# Altium schematic sheet ELoad_rev0.1.SchDoc
size A3
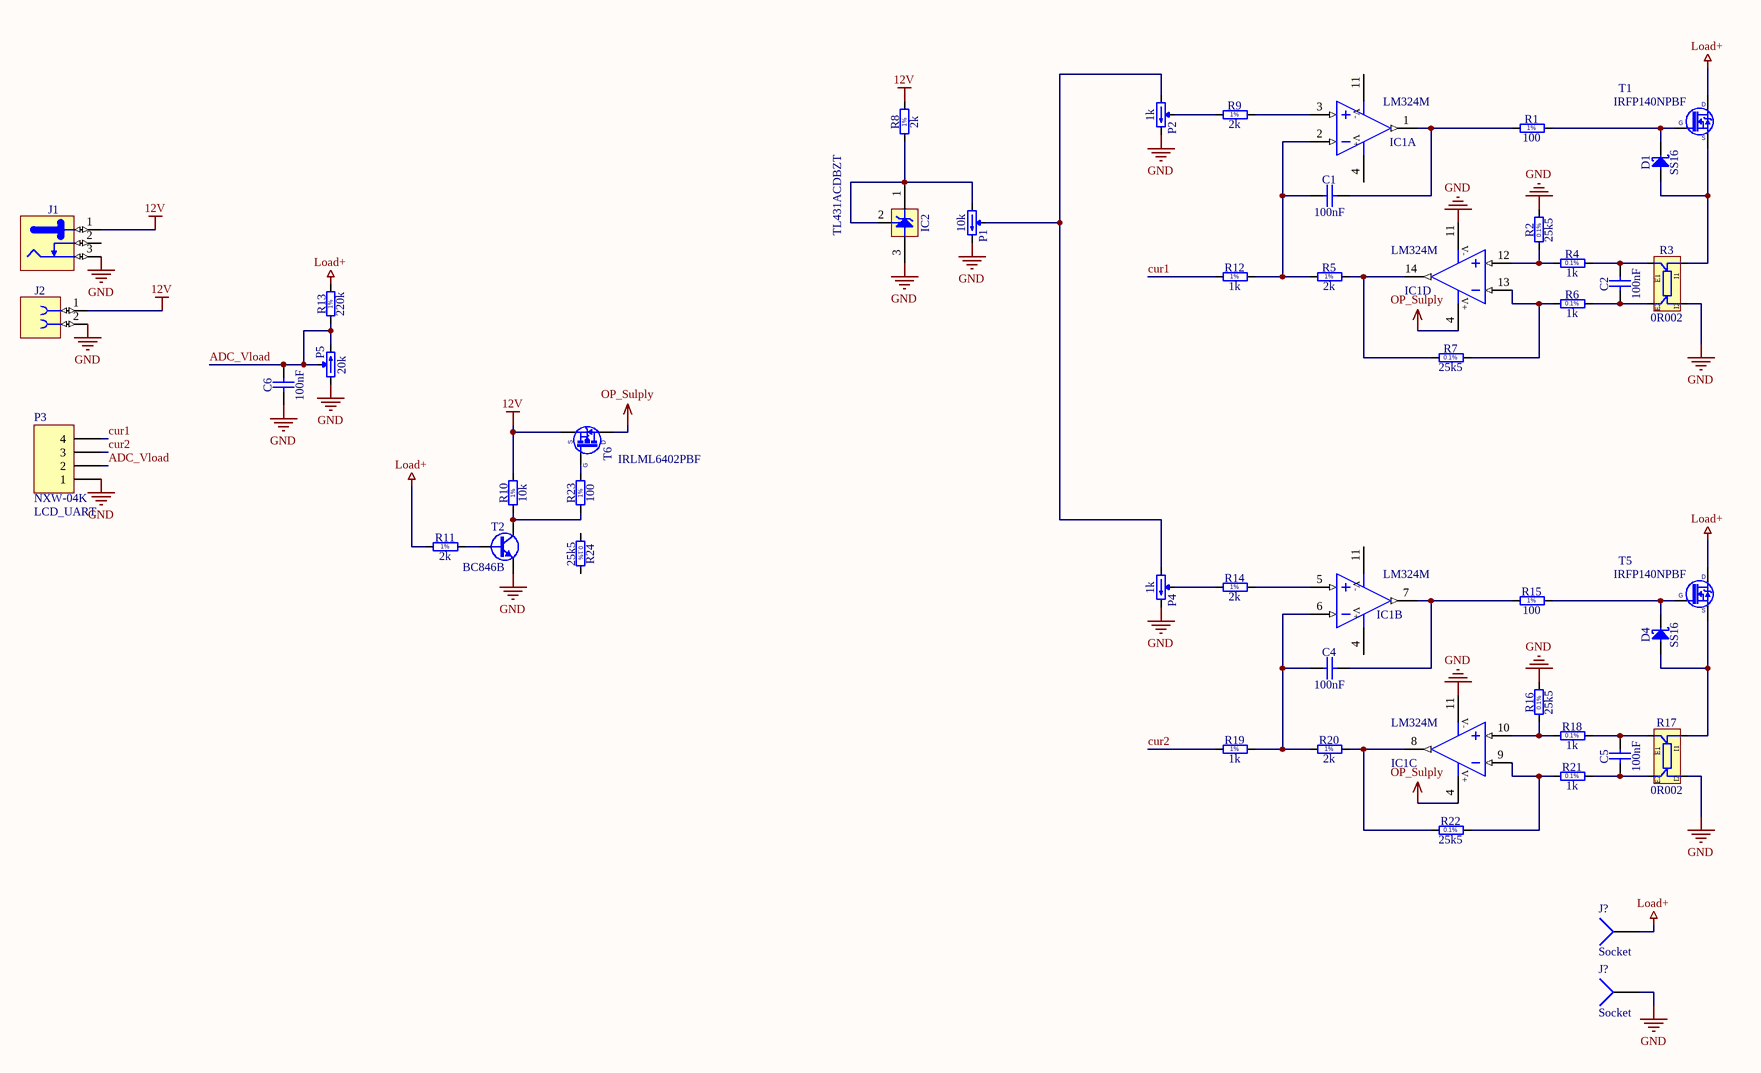
[diagram p0: ELoad_rev0.1.SchDoc]

## Parts
(Parts that share a designator on the sheet are numbered #1, #2 ... from top to bottom, then left to right.)
C1  100nF  [CAPC2012X135N]
C2  100nF  [CAPC2012X135N]
C4  100nF  [CAPC2012X135N]
C5  100nF  [CAPC2012X135N]
C6  100nF  [CAPC2012X88N]
D1  SS16  [DIOM5127X229N]
D4  SS16  [DIOM5127X229N]
IC1  LM324M  [SOIC127P600X175-14N]  (parts A,B,C,D of 4)
IC2  TL431ACDBZT  [SOT95P237X112-3N]
J1  Jack  [CLIFF_FC68148(DC-10A)]  (value not drawn)
J2  (no value)  [PHOENIX_1792863]
J?#1  Socket  [PIN1]
J?#2  Socket  [PIN1]
P1  10k  [3590S]
P2  1k  [TRIM_BOURNS_3290W]
P3  NXW-04K  Parameter 1: LCD_UART  [NXW-04K]
P4  1k  [TRIM_BOURNS_3290W]
P5  20k  [TRIM_BOURNS_3290W]
R1  100  [RESC2012X60N]
R2  25k5  [RESC2012X60N]
R3  0R002  [RES_VISHAY_WSK2512_0R005-0R2]
R4  1k  [RESC2012X60N]
R5  2k  [RESC2012X60N]
R6  1k  [RESC2012X60N]
R7  25k5  [RESC2012X60N]
R8  2k  [RESC2012X60N]
R9  2k  [RESC2012X60N]
R10  10k  [RESC2012X60N]
R11  2k  [RESC2012X60N]
R12  1k  [RESC2012X60N]
R13  220k  [RESC2012X60N]
R14  2k  [RESC2012X60N]
R15  100  [RESC2012X60N]
R16  25k5  [RESC2012X60N]
R17  0R002  [RES_VISHAY_WSK2512_0R005-0R2]
R18  1k  [RESC2012X60N]
R19  1k  [RESC2012X60N]
R20  2k  [RESC2012X60N]
R21  1k  [RESC2012X60N]
R22  25k5  [RESC2012X60N]
R23  100  [RESC2012X60N]
R24  25k5  [RESC2012X60N]
T1  IRFP140NPBF  [TO-247AC-v]
T2  BC846B  [SOT95P230X110-3N]
T5  IRFP140NPBF  [TO-247AC-v]
T6  IRLML6402PBF  [SOT95P237X112-3N]

## Nets
12V: J1.1 J2.1 R8.2 R10.2 T6.2(S)
GND: C6.1 IC1.11(V-) IC2.3(A) J1.3 J2.2 J?#2.1 P1.3(CW) P2.3(CW) P3.1 P4.3(CW) P5.1(CCW) R2.2 R3.I2 R16.2 R17.I2 T2.2(E)
Load+: J?#1.1 R11.1 R13.2 T1.2(D) T5.2(D)
OP_Sulply: IC1.4(V+) T6.3(D)
ADC_Vload: C6.2 P3.2 P5.2(W) P5.3(CW) R13.1
cur1: P3.4 R12.1
cur2: P3.3 R19.1
NetC1_1: C1.1 IC1.2(IN-) R5.1 R12.2
NetC1_2: C1.2 IC1.1(OUT) R1.1
NetC2_1: C2.1 R3.E2 R6.2
NetC2_2: C2.2 R3.E1 R4.2
NetC4_1: C4.1 IC1.6(IN-) R19.2 R20.1
NetC4_2: C4.2 IC1.7(OUT) R15.1
NetC5_1: C5.1 R17.E2 R21.2
NetC5_2: C5.2 R17.E1 R18.2
NetD1_1: D1.1(C) R1.2 T1.1(G)
NetD1_2: D1.2(A) R3.I1 T1.3(S)
NetD4_1: D4.1(C) R15.2 T5.1(G)
NetD4_2: D4.2(A) R17.I1 T5.3(S)
NetIC1_3: IC1.3(IN+) R9.2
NetIC1_5: IC1.5(IN+) R14.2
NetIC1_8: IC1.8(OUT) R20.2 R22.1
NetIC1_9: IC1.9(IN-) R21.1 R22.2
NetIC1_10: IC1.10(IN+) R16.1 R18.1
NetIC1_12: IC1.12(IN+) R2.1 R4.1
NetIC1_13: IC1.13(IN-) R6.1 R7.2
NetIC1_14: IC1.14(OUT) R5.2 R7.1
NetIC2_1: IC2.1(C) IC2.2(Adj) P1.1(CCW) R8.1
NetP1_2: P1.2(W) P2.1(CCW) P4.1(CCW)
NetP2_2: P2.2(W) R9.1
NetP4_2: P4.2(W) R14.1
NetR10_1: R10.1 R23.1 T2.3(C)
NetR11_2: R11.2 T2.1(B)
NetR23_2: R23.2 T6.1(G)

Not connected (* = marked no-connect by the designer): J1 2; R24 1 2

## Notes on the sheet
- Title
- Size:
- Date:
- A3
- Number:
- Time:
- Revision:
- Sheet
- of
- File:
- (in symbol R0805_1K_0.1%_0.125W_25PPM) 0.1%
- (in symbol R0805_1K_1%_0.125W_100PPM) 1%
- (in symbol R0805_2K_1%_0.125W_100PPM) 1%
- (in symbol R0805_10K_1%_0.125W_100PPM) 1%
- (in symbol R0805_25K5_0.1%_0.1W_10PPM) 0.1%
- (in symbol R0805_100R_1%_0.125W_100PPM) 1%
- (in symbol R0805_220K_1%_0.125W_100PPM) 1%

## Library data of the parts
C1 C2 C4 C5 = CC0805_100NF_50V_10%_X7R: Non-polarised capacitor; Part Description: SMD Multilayer Chip Ceramic Capacitor; Manufacturer: GENERIC; Manufacturer1 Part Number: C2012X7R1H104K085AA; Voltage: 50V; TC: X7R; Tolerance: ±10%; Part Number: CC0805_100NF_50V_10%_X7R; Component Kind: Standard; Component Type: Standard; Pin Count: 2; Value: 100nF; Status: Preferred; Manufacturer Part Number: CC0805_100NF_50V_10%_X7R; Case: 0805; Mounted: Yes; Socket: No; SMD: Yes; Sense: No; Manufacturer1 Example: TDK; Manufacturer1 ComponentHeight: 1mm; HelpURL: \\cern.ch\dfs\Applications\Altium\Datasheets\CC0805_X7R_TDK_C.pdf; Author: CERN DEM JLC; CreateDate: 12/3/2007; LatestRevisionDate: 4/22/2015
C6 = CC0805_100NF_50V_10%_X7R_YUDEN_UMK212B7104KGH: Non-polarised capacitor; Part Description: SMD Multilayer Chip Ceramic Capacitor (High Dielectric Type) for Automotive / Industrial Applications; Manufacturer: TAIYO YUDEN; Voltage: 50V; TC: X7R; Tolerance: ±10%; Part Number: CC0805_100NF_50V_10%_X7R_YUDEN_UMK212B7104KGH; Component Kind: Standard; Component Type: Standard; Pin Count: 2; Value: 100nF; Status: Not Recommended; Manufacturer Part Number: UMK212B7104KGH; Case: 0805; Mounted: Yes; Socket: No; SMD: Yes; Sense: No; ComponentHeight: 1.35mm; HelpURL: \\cern.ch\dfs\Applications\Altium\Datasheets\CC0805_TAIYO-YUDEN_UMK212B7104KGH.pdf; Author: CERN DEM JLC; CreateDate: 23.04.2015; LatestRevisionDate: 23.04.2015
D1 D4 = SS16: Schottky Diode; Part Description: Surface Mount Schottky Barrier Rectifier; Manufacturer: VISHAY GENERAL SEMICONDUCTOR; Voltage: 60V; Power: 1A; PressFit: No; Bonding: No; Part Number: SS16; Component Kind: Standard; Component Type: Standard; Device: SS16; PackageDescription: DO-214-AC Molded Diode, Body 5.1x2.7mm, IPC Medium Density; Manufacturer Part Number: SS16; Pin Count: 2; Case: DO-214AC; Mounted: Yes; Socket: No; SMD: Yes; Sense: No; ComponentHeight: 2.29mm; HelpURL: \\cern.ch\dfs\Applications\Altium\Datasheets\SS16.pdf; Author: CERN DEM JLC; CreateDate: 7/15/2008; LatestRevisionDate: 8/23/2010
IC1 = LM324M: Quad Operational Amplifier; Manufacturer: FAIRCHILD SEMICONDUCTOR; PressFit: No; Bonding: No; Part Number: LM324M; Component Kind: Standard; Component Type: Standard; Device: LM324M; PackageDescription: SOIC 14, Pitch 1.27mm - Body 4x8.75mm, IPC Medium Density; Status: Not recommended; Part Description: Quad Operational Amplifier; Manufacturer Part Number: LM324M; Pin Count: 14; Case: SOIC14; Mounted: Yes; Socket: No; SMD: Yes; Sense: No; ComponentHeight: 1.80mm; Author: CERN DEM JLC; HelpURL: \\cern.ch\dfs\Applications\Altium\Datasheets\LM324M.pdf; CreateDate: 8/20/2008; LatestRevisionDate: 8/20/2008
IC2 = TL431ACDBZT: Precision Reference 1=Cathode 2=Adj 3=Anode; Part Description: Vref (2.5V) To 36V 1% Precision Programmable Reference; Manufacturer: TEXAS INSTRUMENTS; PressFit: No; Bonding: No; Part Number: TL431ACDBZT; Component Kind: Standard; Component Type: Standard; Device: TL431ACDBZT; PackageDescription: SOT, 0.95mm, Pitch; 3 pin,1.30mm W X 2.92mm L X 1.12mm H Body, IPC Medium Density; Manufacturer Part Number: TL431ACDBZT; Pin Count: 3; Case: SOT23; Mounted: Yes; Socket: No; SMD: Yes; Sense: No; ComponentHeight: 1.12mm; HelpURL: \\cern.ch\dfs\Applications\Altium\Datasheets\TL431ACDBZT.pdf; Author: CERN DEM JLC; CreateDate: 2/28/2011; LatestRevisionDate: 2/28/2011
J1 = CLIFF_FC68148(DC-10A): 12V /  5A, 2.1mm Diameter Pin, DC Power Socket With  Switch. DC10A Type; Part Description: 12V/5A, 2.1mm Diameter Pin, DC Power Socket With  Switch (DC10A Type); Manufacturer: CLIFF ELECTRONIC COMPONENTS; PressFit: No; Part Number: CLIFF_FC68148(DC-10A); Component Kind: Standard; Component Type: Standard; Pin Count: 3; Family: Jack; Mounted: Yes; Socket: No; SMD: No; Sense: No; Status: None; Manufacturer Part Number: FC68148 (DC-10A); ComponentHeight: 11mm; HelpURL: \\cern.ch\dfs\Applications\Altium\Datasheets\CLIFF_FC68148(DC-10A).pdf; Author: CERN DEM JLC; CreateDate: 11/23/2010; LatestRevisionDate: 11/23/2010
J2 = PHOENIX_1792863: Connector 2 Female; Part Description: 12A 400V, Pitch: 5mm, 2 Positions Terminal Block (Spring-Cage Connection); Manufacturer: PHOENIX CONTACT; Manufacturer Part Number: 1792863 (PTS 1,5/ 2-5,0-H); PressFit: No; Part Number: PHOENIX_1792863; Component Kind: Standard; Component Type: Standard; Pin Count: 2; Mounted: Yes; Socket: No; SMD: No; Sense: No; Status: None; ComponentHeight: 9.2mm; HelpURL: \\cern.ch\dfs\Applications\Altium\Datasheets\PHOENIX_1792863.pdf; Author: CERN DEM JLC; CreateDate: 3/24/2014; LatestRevisionDate: 3/24/2014
P1 = TRIM_25T_10K_BOURNS_3296Y-1-103LF: Trimming Potentiometer; Part Description: 25 Turn Trimming Potentiometer (Top Adjustement); Manufacturer: BOURNS; Power: 0.5W; TC: ±100ppm/°C; Tolerance: ±10%; PressFit: No; Part Number: TRIM_25T_10K_BOURNS_3296Y-1-103LF; Component Kind: Standard; Component Type: Standard; Footprint: TRIM_BOURNS_3296Y; Pin Count: 3; Value: 10k; Manufacturer Part Number: 3296Y-1-103LF; Case: 3296Y; Mounted: Yes; Socket: No; SMD: No; Sense: No; ComponentHeight: 11.55mm; HelpURL: \\cern.ch\dfs\Applications\Altium\Datasheets\TRIM_BOURNS_3296Y.pdf; Author: CERN DEM JLC; CreateDate: 10/20/2008; LatestRevisionDate: 11/28/2012
P2 P4 = TRIM_25T_1K_BOURNS_3290W-1-102: Trimming Potentiometer; Part Description: 25 Turn Trimming Potentiometer (Top Adjustement); Manufacturer: BOURNS; Power: 1W; TC: ±50ppm/°C; Tolerance: ±5%; PressFit: No; Part Number: TRIM_25T_1K_BOURNS_3290W-1-102; Component Kind: Standard; Component Type: Standard; Pin Count: 3; Value: 1k; Manufacturer Part Number: 3290W-1-102; Case: 3290W; Mounted: Yes; Socket: No; SMD: No; Sense: No; ComponentHeight: 9.91mm; HelpURL: \\cern.ch\dfs\Applications\Altium\Datasheets\TRIM_BOURNS_3290W.pdf; Author: CERN DEM MR; CreateDate: 11/23/2016; LatestRevisionDate: 11/23/2016
P3 = Header 4: Header, 4-Pin; LatestRevisionDate: 17-Jul-2002; LatestRevisionNote: Re-released for DXP Platform.; Publisher: Altium Limited
P5 = TRIM_25T_20K_BOURNS_3290W-1-203: Trimming Potentiometer; Part Description: 25 Turn Trimming Potentiometer (Top Adjustement); Manufacturer: BOURNS; Power: 1W; TC: ±50ppm/°C; Tolerance: ±5%; PressFit: No; Part Number: TRIM_25T_20K_BOURNS_3290W-1-203; Component Kind: Standard; Component Type: Standard; Pin Count: 3; Value: 20k; Manufacturer Part Number: 3290W-1-203; Case: 3290W; Mounted: Yes; Socket: No; SMD: No; Sense: No; ComponentHeight: 9.91mm; HelpURL: \\cern.ch\dfs\Applications\Altium\Datasheets\TRIM_BOURNS_3290W.pdf; Author: CERN DEM BC; CreateDate: 3/1/2017; LatestRevisionDate: 3/1/2017
R1 R15 R23 = R0805_100R_1%_0.125W_100PPM: Resistor - 1%; Part Description: General Purpose Thick Film Chip Resistor; Manufacturer: GENERIC; Manufacturer1 Part Number: NRC10F4700TRF; Power: 0.125W; TC: ±100ppm/°C; PressFit: No; Part Number: R0805_100R_1%_0.125W_100PPM; Component Kind: Standard; Component Type: Standard; Pin Count: 2; Value: 100; Status: Preferred; Tolerance: ±1%; Manufacturer Part Number: R0805_100R_1%_0.125W_100PPM; Case: 0805; Mounted: Yes; Sense: No; Socket: No; SMD: Yes; Manufacturer1 Example: NIC COMPONENT; Manufacturer1 ComponentHeight: 0.6mm; HelpURL: \\cern.ch\dfs\Applications\Altium\Datasheets\R0805_NIC_NRC.pdf; Author: CERN DEM JLC; CreateDate: 12/3/2007; LatestRevisionDate: 3/13/2008
R2 R7 R16 R22 R24 = R0805_25K5_0.1%_0.1W_10PPM: Resistor - 0.1%; Part Description: Thin Film Chip Resistor; Manufacturer: GENERIC; Manufacturer1 Part Number: RN73C2A25K5BTG; Power: 0.1W; TC: ±10ppm; PressFit: No; Part Number: R0805_25K5_0.1%_0.1W_10PPM; Component Kind: Standard; Component Type: Standard; Pin Count: 2; Value: 25k5; Status: Not Recommended; Tolerance: ±0.1%; Manufacturer Part Number: R0805_25K5_0.1%_0.1W_10PPM; Case: 0805; Mounted: Yes; Sense: No; Socket: No; SMD: Yes; Manufacturer1 Example: TYCO HOLSWORTHY; Manufacturer1 ComponentHeight: 0.6mm; HelpURL: \\cern.ch\dfs\Applications\Altium\Datasheets\R0805_Tyco_RN73.pdf; Author: CERN DEM JLC; CreateDate: 12/3/2007; LatestRevisionDate: 3/13/2008
R3 R17 = R2512_0R002_1%_1W_35PPM_VISHAY_WSK2512: Power and Current Sensing Resistor; Part Description: Power Metal Strip® Resistor, Low Value; Manufacturer: VISHAY DALE; Manufacturer Part Number: WSK25122L000FEA; Power: 1W; TC: ±35ppm/°C; Tolerance: ±1%; PressFit: No; Part Number: R2512_0R002_1%_1W_35PPM_VISHAY_WSK2512; Component Kind: Standard; Component Type: Standard; Pin Count: 4; Value: 0R002; Status: None; Case: 2512; Mounted: Yes; Sense: No; Socket: No; SMD: Yes; ComponentHeight: 0.89mm; HelpURL: \\cern.ch\dfs\Applications\Altium\Datasheets\R2512_VISHAY_WSK2512.pdf; Author: CERN DEM MR; CreateDate: 11/8/2016; LatestRevisionDate: 11/8/2016
R4 R6 R18 R21 = R0805_1K_0.1%_0.125W_25PPM: Resistor - 0.1%; Part Description: Thin Film Chip Resistor; Manufacturer: GENERIC; Manufacturer1 Part Number: ERA6AEB102V; Power: 0.125W; TC: ±25ppm; PressFit: No; Part Number: R0805_1K_0.1%_0.125W_25PPM; Component Kind: Standard; Component Type: Standard; Pin Count: 2; Value: 1k; Status: Not Recommended; Tolerance: ±0.1%; Manufacturer Part Number: R0805_1K_0.1%_0.125W_25PPM; Case: 0805; Mounted: Yes; Sense: No; Socket: No; SMD: Yes; Manufacturer1 Example: PANASONIC; Manufacturer1 ComponentHeight: 0.6mm; HelpURL: \\cern.ch\dfs\Applications\Altium\Datasheets\R0805_PANASONIC_ERA.pdf; Author: CERN DEM JLC; CreateDate: 10/18/2010; LatestRevisionDate: 10/18/2010
R5 R8 R9 R11 R14 R20 = R0805_2K_1%_0.125W_100PPM: Resistor - 1%; Part Description: General Purpose Thick Film Chip Resistor; Manufacturer: GENERIC; Manufacturer1 Part Number: NRC10F2001TRF; Power: 0.125W; TC: ±100ppm/°C; PressFit: No; Part Number: R0805_2K_1%_0.125W_100PPM; Component Kind: Standard; Component Type: Standard; Pin Count: 2; Value: 2k; Status: Preferred; Tolerance: ±1%; Manufacturer Part Number: R0805_2K_1%_0.125W_100PPM; Case: 0805; Mounted: Yes; Sense: No; Socket: No; SMD: Yes; Manufacturer1 Example: NIC COMPONENT; Manufacturer1 ComponentHeight: 0.6mm; HelpURL: \\cern.ch\dfs\Applications\Altium\Datasheets\R0805_NIC_NRC.pdf; Author: CERN DEM JLC; CreateDate: 12/3/2007; LatestRevisionDate: 3/13/2008
R10 = R0805_10K_1%_0.125W_100PPM: Resistor - 1%; Part Description: General Purpose Thick Film Chip Resistor; Manufacturer: GENERIC; Manufacturer1 Part Number: NRC10F1002TRF; Power: 0.125W; TC: ±100ppm/°C; PressFit: No; Part Number: R0805_10K_1%_0.125W_100PPM; Component Kind: Standard; Component Type: Standard; Pin Count: 2; Value: 10k; Status: Preferred; Tolerance: ±1%; Manufacturer Part Number: R0805_10K_1%_0.125W_100PPM; Case: 0805; Mounted: Yes; Sense: No; Socket: No; SMD: Yes; Manufacturer1 Example: NIC COMPONENT; Manufacturer1 ComponentHeight: 0.6mm; HelpURL: \\cern.ch\dfs\Applications\Altium\Datasheets\R0805_NIC_NRC.pdf; Author: CERN DEM JLC; CreateDate: 12/3/2007; LatestRevisionDate: 3/13/2008
R12 R19 = R0805_1K_1%_0.125W_100PPM: Resistor - 1%; Part Description: General Purpose Thick Film Chip Resistor; Manufacturer: GENERIC; Manufacturer1 Part Number: NRC10F1001TRF; Power: 0.125W; TC: ±100ppm/°C; PressFit: No; Part Number: R0805_1K_1%_0.125W_100PPM; Component Kind: Standard; Component Type: Standard; Pin Count: 2; Value: 1k; Status: Preferred; Tolerance: ±1%; Manufacturer Part Number: R0805_1K_1%_0.125W_100PPM; Case: 0805; Mounted: Yes; Sense: No; Socket: No; SMD: Yes; Manufacturer1 Example: NIC COMPONENT; Manufacturer1 ComponentHeight: 0.6mm; HelpURL: \\cern.ch\dfs\Applications\Altium\Datasheets\R0805_NIC_NRC.pdf; Author: CERN DEM JLC; CreateDate: 12/3/2007; LatestRevisionDate: 3/13/2008
R13 = R0805_220K_1%_0.125W_100PPM: Resistor - 1%; Part Description: General Purpose Thick Film Chip Resistor; Manufacturer: GENERIC; Manufacturer1 Part Number: NRC10F2203TRF; Power: 0.125W; TC: ±100ppm/°C; PressFit: No; Part Number: R0805_220K_1%_0.125W_100PPM; Component Kind: Standard; Component Type: Standard; Pin Count: 2; Value: 220k; Status: Preferred; Tolerance: ±1%; Manufacturer Part Number: R0805_220K_1%_0.125W_100PPM; Case: 0805; Mounted: Yes; Sense: No; Socket: No; SMD: Yes; Manufacturer1 Example: NIC COMPONENT; Manufacturer1 ComponentHeight: 0.6mm; HelpURL: \\cern.ch\dfs\Applications\Altium\Datasheets\R0805_NIC_NRC.pdf; Author: CERN DEM JLC; CreateDate: 12/3/2007; LatestRevisionDate: 3/13/2008
T1 T5 = IRFP140NPBF_v: N-CHANNEL MOSFET WITH ZENER DIODE; Part Description: 100V 33A N-Channel HEXFET® Power MOSFET; Manufacturer: INTERNATIONAL RECTIFIER; PressFit: No; Bonding: No; Part Number: IRFP140NPBF_v; Component Kind: Standard; Component Type: Standard; Device: IRFP140NPBF; PackageDescription: TO-247AC 3-Terminal - Vertical Mount; Manufacturer Part Number: IRFP140NPBF; Pin Count: 3; Case: TO-247; Mounted: Yes; Socket: No; SMD: No; Sense: No; ComponentHeight: 24.6mm; HelpURL: \\cern.ch\dfs\Applications\Altium\Datasheets\IRFP140NPBF.pdf; Author: CERN DEM JLC; CreateDate: 1/16/2012; LatestRevisionDate: 1/16/2012
T2 = BC846B: NPN Transistor; Part Description: 65 V 100mA NPN general-purpose transistors; Manufacturer: NXP SEMICONDUCTORS; PressFit: No; Bonding: No; Part Number: BC846B; Component Kind: Standard; Component Type: Standard; Device: BC846B; PackageDescription: SOT23, 3 pin, Pitch 0.95mm - 1.3mm W X 2.9mm L X 1.1mm H, IPC Medium Density; Manufacturer Part Number: BC846B; Pin Count: 3; Case: SOT23-3; Mounted: Yes; Socket: No; SMD: Yes; Sense: No; ComponentHeight: 1.1mm; HelpURL: \\cern.ch\dfs\Applications\Altium\Datasheets\BC846B.pdf; Author: CERN DEM JLC; CreateDate: 10.03.2011; LatestRevisionDate: 10.03.2011
T6 = IRLML6402PBF: P-CHANNEL MOSFET WITH ZENER DIODE; Part Description: -20V -3.7A P-Channel HEXFET® Power MOSFET; Manufacturer: INTERNATIONAL RECTIFIER; PressFit: No; Bonding: No; Part Number: IRLML6402PBF; Component Kind: Standard; Component Type: Standard; Device: IRLML6402PBF; PackageDescription: SOT, 0.95mm, pitch; 3 pin,1.30mm W X 2.92mm L X 1.12mm H body, IPC Medium Density; Manufacturer Part Number: IRLML6402PBF; Pin Count: 3; Case: SOT23-3; Mounted: Yes; Socket: No; SMD: Yes; Sense: No; ComponentHeight: 1.12mm; HelpURL: \\cern.ch\dfs\Applications\Altium\Datasheets\IRLML6402PBF.pdf; Author: CERN DEM JLC; CreateDate: 8/29/2011; LatestRevisionDate: 8/29/2011
J?#1 J?#2 = Socket: LatestRevisionDate: 17-Jul-2002; LatestRevisionNote: Re-released for DXP Platform.; Publisher: Altium Limited